# Altium schematic sheet Audio.SchDoc
size A
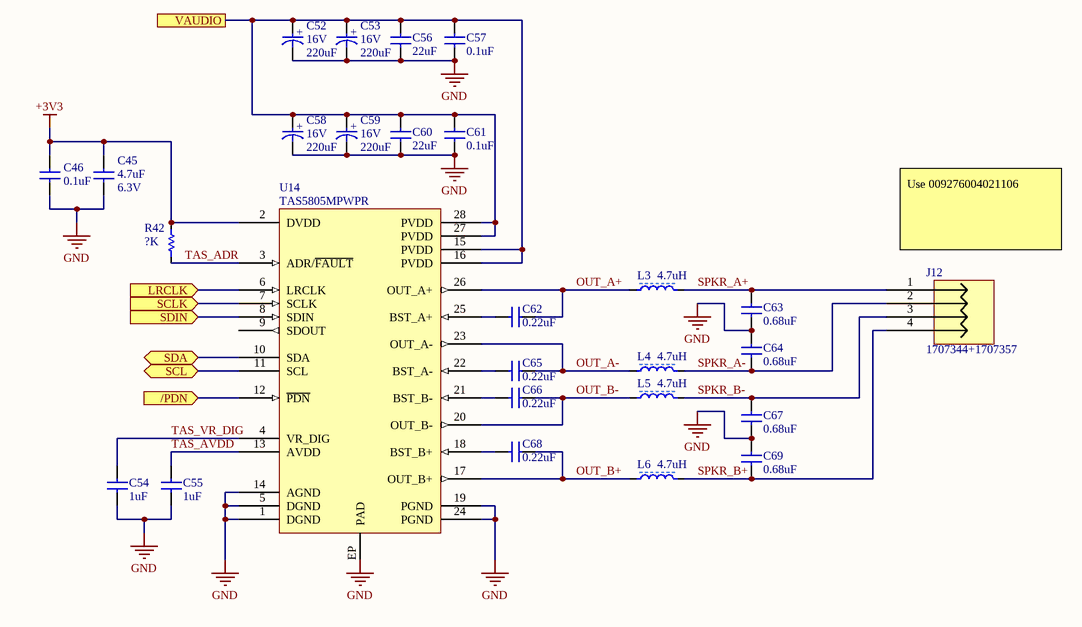
[diagram p0: Audio.SchDoc]

## Parts
C45  value 4.7uF  Voltage: 6.3V  [0603_Capacitor]  (hidden comment: CAP 4.7uF 6.3V X5R)
C46  value 0.1uF  [0402_CAPACITOR]  (hidden comment: CAP 0.1uF 16V X7R)
C52  value 220uF  Voltage Rating: 16V  [CAP_6.3x8mm_SMD]  (hidden comment: APXG160ARA221MF80G)
C53  value 220uF  Voltage Rating: 16V  [CAP_6.3x8mm_SMD]  (hidden comment: APXG160ARA221MF80G)
C54  value 1uF  [0603_CAPACITOR]  (hidden comment: CAP 1uF 16V X7R)
C55  value 1uF  [0603_CAPACITOR]  (hidden comment: CAP 1uF 16V X7R)
C56  value 22uF  [0805_Capacitor]  (hidden comment: CAP 22uF 16V X5R)
C57  value 0.1uF  [0603_CAPACITOR]  (hidden comment: CAP 0.1uF 50V X7R)
C58  value 220uF  Voltage Rating: 16V  [CAP_6.3x8mm_SMD]  (hidden comment: APXG160ARA221MF80G)
C59  value 220uF  Voltage Rating: 16V  [CAP_6.3x8mm_SMD]  (hidden comment: APXG160ARA221MF80G)
C60  value 22uF  [0805_Capacitor]  (hidden comment: CAP 22uF 16V X5R)
C61  value 0.1uF  [0603_CAPACITOR]  (hidden comment: CAP 0.1uF 50V X7R)
C62  value 0.22uF  [0603_CAPACITOR]  (hidden comment: CAP 0.22uF 25V X7R)
C63  value 0.68uF  [0805_Capacitor]  (hidden comment: CAP 0.68uF 25V X7R)
C64  value 0.68uF  [0805_Capacitor]  (hidden comment: CAP 0.68uF 25V X7R)
C65  value 0.22uF  [0603_CAPACITOR]  (hidden comment: CAP 0.22uF 25V X7R)
C66  value 0.22uF  [0603_CAPACITOR]  (hidden comment: CAP 0.22uF 25V X7R)
C67  value 0.68uF  [0805_Capacitor]  (hidden comment: CAP 0.68uF 25V X7R)
C68  value 0.22uF  [0603_CAPACITOR]  (hidden comment: CAP 0.22uF 25V X7R)
C69  value 0.68uF  [0805_Capacitor]  (hidden comment: CAP 0.68uF 25V X7R)
J12  1707344+1707357  [1707344(3)+1707357(1)]
L3  value 4.7uH  [L_SRN6045]  (hidden comment: SRN6045TA-4R7M)
L4  value 4.7uH  [L_SRN6045]  (hidden comment: SRN6045TA-4R7M)
L5  value 4.7uH  [L_SRN6045]  (hidden comment: SRN6045TA-4R7M)
L6  value 4.7uH  [L_SRN6045]  (hidden comment: SRN6045TA-4R7M)
R42  value ?K  [0402_Resistor]  (hidden comment: R_0402_?K_1%)
U14  TAS5805MPWPR  [TSSOP-28-EP]

## Ports
/PDN (in), LRCLK (in), SCL (bidir), SCLK (in), SDA (bidir), SDIN (in), VAUDIO

## Nets
+3V3: C45.2 C46.1 R42.2 U14.2(DVDD)
GND: C45.1 C46.2 C52.2 C53.2 C54.2 C55.2 C56.2 C57.2 C58.2 C59.2 C60.2 C61.2 C63.2 C64.1 C67.2 C69.1 U14.1(DGND) U14.5(DGND) U14.14(AGND) U14.19(PGND) U14.24(PGND) U14.EP(PAD)
/PDN: U14.12(~{PDN}) ; port /PDN
LRCLK: U14.6(LRCLK) ; port LRCLK
OUT_A+: C62.1 L3.1 U14.26(OUT_A+)
OUT_A-: C65.1 L4.1 U14.23(OUT_A-)
OUT_B+: C68.1 L6.1 U14.17(OUT_B+)
OUT_B-: C66.1 L5.1 U14.20(OUT_B-)
SCL: U14.11(SCL) ; port SCL
SCLK: U14.7(SCLK) ; port SCLK
SDA: U14.10(SDA) ; port SDA
SDIN: U14.8(SDIN) ; port SDIN
SPKR_A+: C63.1 J12.1 L3.2
SPKR_A-: C64.2 J12.2 L4.2
SPKR_B+: C69.2 J12.4 L6.2
SPKR_B-: C67.1 J12.3 L5.2
TAS_ADR: R42.1 U14.3(ADR/~{FAULT})
TAS_AVDD: C55.1 U14.13(AVDD)
TAS_VR_DIG: C54.1 U14.4(VR_DIG)
VAUDIO: C52.1 C53.1 C56.1 C57.1 C58.1 C59.1 C60.1 C61.1 U14.15(PVDD) U14.16(PVDD) U14.27(PVDD) U14.28(PVDD) ; port VAUDIO
NetC62_2: C62.2 U14.25(BST_A+)
NetC65_2: C65.2 U14.22(BST_A-)
NetC66_2: C66.2 U14.21(BST_B-)
NetC68_2: C68.2 U14.18(BST_B+)

Not connected (* = marked no-connect by the designer): U14 9(SDOUT)

## Notes on the sheet
- (near J12) Use 009276004021106
- (in symbol C_APXG160ARA221MF80G) +

## Library data of the parts
C45 = C_0603_4.7uF_6.3V_10%: CAP CER 4.7UF 6.3V X5R 0603; Package: =SelectedPackage; Temperature Coefficient: X5R; Supplier 1: Digi-Key; Supplier Part Number 1: 1276-1045-1-ND
C46 = C_0402_0.1uF_16V_10%: CAP CERM 0.1uF 10% 16V 0402; Package: =SelectedPackage; Voltage: 16V; Temperature Coefficient: X7R; Supplier 1: Digi-Key; Supplier Part Number 1: 1276-1001-1-ND; Supplier 2: Digi-Key; Supplier Part Number 2: 587-1451-1-ND
C52 C53 C58 C59 = C_APXG160ARA221MF80G: 220µF 16V Aluminum Polymer Capacitor Radial, Can - SMD 22 mOhm 15000 Hrs @ 105°C; Manufacturer: United Chemi-Con; ESR (Equivalent Series Resistance): 22mR; Life (Hours): 15000Hour; Tolerance: 20%; Ripple Current: 3.3A; Supplier 1: Digi-Key; Supplier Part Number 1: 565-4283-6-ND; Manufacturer Part Number: APXG160ARA221MF80G; Min Operating Temperature: -55°C; Max Operating Temperature: 105°C
C54 C55 = C_0603_1uF_16V_10%: CAP CERM 1uF 10% 16V 0603; SVP Creator: Spencer Berglund; Package: =SelectedPackage; Voltage: 16V; Temperature Coefficient: X7R; Supplier 1: Digi-Key; Supplier Part Number 1: 1276-6524-6-ND
C56 C60 = C_0805_22uF_16V_20%: CAP CERM 22uF 20% 16V 0805; Package: =SelectedPackage; Voltage: 16V; Temperature Coefficient: X5R; Supplier 1: Digi-Key; Supplier Part Number 1: 1276-6780-6-ND
C57 C61 = C_0603_0.1uF_50V_10%: CAP CERM 0.1uF 10% 50V 0603; SVP Creator: Spencer Berglund; Package: =SelectedPackage; Voltage: 50V; Temperature Coefficient: X7R; Supplier 1: Digi-Key; Supplier Part Number 1: 1276-1000-1-ND
C62 C65 C66 C68 = C_0603_0.22uF_25V_10%: CAP CER 0.22UF 25V X7R 0603; Package: =SelectedPackage; Voltage: 25V; Temperature Coefficient: X7R; Supplier 1: Arrow; Supplier 2: Digi-Key; Supplier Part Number 1: CL10B224KA8NNNC; Supplier Part Number 2: 1276-1111-1-ND
C63 C64 C67 C69 = C_0805_0.68uF_25V_10%: CAP CERM 0.68uF 10% 25V 0805; Package: =SelectedPackage; Voltage: 25V; Temperature Coefficient: X7R; Supplier 1: Digi-Key; Supplier 2: Mouser; Supplier Part Number 1: 311-3386-1-ND; Supplier Part Number 2: 603-CC805KKX7R8BB684
J12 = J_PHOENIX_4T_3.81: PCB terminal block ZFKDS 3.81mm vertical, 4 pin; Supplier 1: Digi-Key; Supplier Part Number 1: 277-6731-ND; Supplier 2: Digi-Key; Supplier Part Number 2: 1707357-ND
L3-L6 = L_SRN6045TA-4R7M: 4.7µH Semi-Shielded Wirewound Inductor 4.5A 26mOhm Nonstandard; Manufacturer: Bourns; Inductance Tolerance: 20%; Saturation Current: 6.8A; DC Resistance (DCR): 26mR; RMS Current (Irms): 4.5A; Manufacturer Part Number: SRN6045TA-4R7M; Supplier 1: Digi-Key; Supplier Part Number 1: SRN6045TA-4R7MCT-ND
R42 = R_0402_generic_1%: Generic 0402 Resistor (10.2R to 10M); Manufacturer: Yageo; Power Rating: 0.0625W; Temperature Coefficient: ±100ppm/°C; Tolerance: ±1%; Voltage Rating: 50V; Operating Temperature: -55°C ~ 155°C; Manufacturer Part Number: ='RC0402FR-07'+ValueFormatted+'L'; HelpURL: https://www.digikey.com/products/en/resistors/chip-resistor-surface-mount/52?pv17=103&FV=fffc000d%2Cc0001%2C1c0002%2C1f140000%2Cffe00034&k=RC0402; ValueFormatted: =Copy(Copy(Value, 0, Pos('.', Value)-1)+Copy(Value, Length(Value), 1)+Copy(Value, Pos('.', Value)+1, Length(Value)-Pos('.', Value)-1),1,Pos('.',Value)*Length(Value))+Copy(Value,1,Length(Value)*(1-Pos('.',Value)))
U14 = U_TAS5805M: Amplifier IC 1-Channel (Mono) or 2-Channel (Stereo) Class D 28-HTSSOP; Manufacturer: Texas Instruments; Supplier 1: Digi-Key; Supplier 2: Arrow; Supplier Part Number 1: 296-51627-1-ND; Supplier Part Number 2: TAS5805MPWPR; Manufacturer Part Number: TAS5805MPWPR